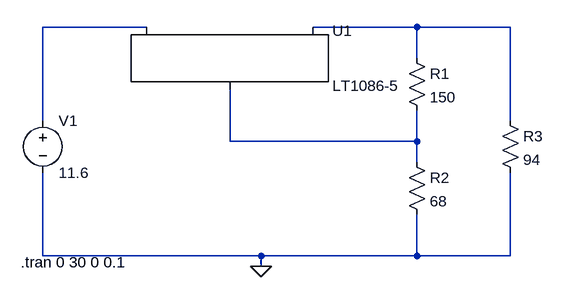
[diagram p0: schematic Draft2.asc]
Draft2.asc, the LTspice schematic file:
Version 4
SHEET 1 880 680
WIRE -16 208 -176 208
WIRE 400 208 240 208
WIRE 544 208 400 208
WIRE 400 256 400 208
WIRE -176 352 -176 208
WIRE 544 352 544 208
WIRE 112 384 112 304
WIRE 400 384 400 336
WIRE 400 384 112 384
WIRE 400 416 400 384
WIRE -176 560 -176 432
WIRE 160 560 -176 560
WIRE 400 560 400 496
WIRE 400 560 160 560
WIRE 544 560 544 432
WIRE 544 560 400 560
WIRE 160 576 160 560
FLAG 160 576 0
SYMBOL PowerProducts\\LT1086-5 112 208 R0
SYMATTR InstName U1
SYMBOL voltage -176 336 R0
WINDOW 123 0 0 Left 0
WINDOW 39 0 0 Left 0
SYMATTR InstName V1
SYMATTR Value 11.6
SYMBOL res 384 240 R0
SYMATTR InstName R1
SYMATTR Value 150
SYMBOL res 384 400 R0
SYMATTR InstName R2
SYMATTR Value 68
SYMBOL res 528 336 R0
SYMATTR InstName R3
SYMATTR Value 94
TEXT -210 570 Left 0 !.tran 0 30 0 0.1

The netlist it stands for:
* Draft2.asc
XU1 N003 N002 N001 LT1086-5
V1 N001 0 11.6
R1 N002 N003 150
R2 N003 0 68
R3 N002 0 94
.tran 0 30 0 0.1
.backanno
.end